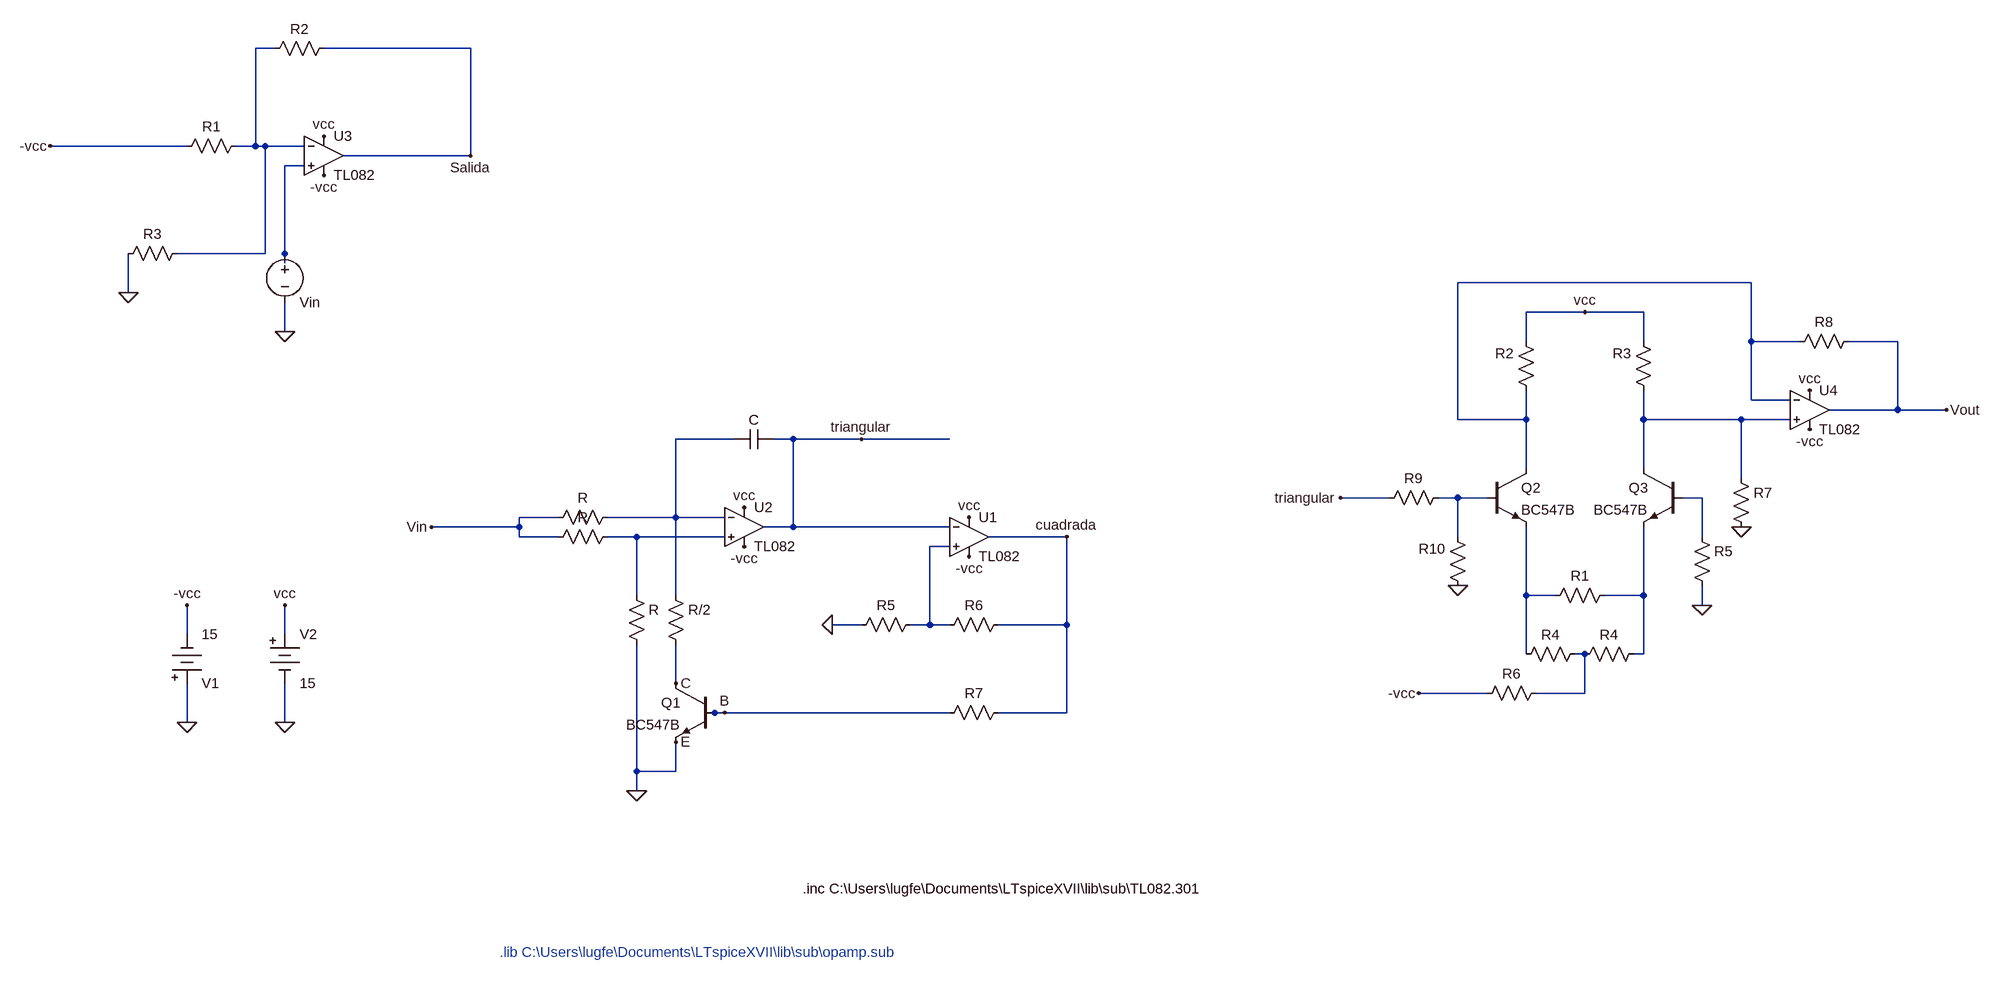
[diagram p0: schematic vco - Copy.asc]
vco - Copy.asc, the LTspice schematic file:
Version 4
SHEET 1 2788 924
WIRE -656 -656 -688 -656
WIRE -336 -656 -576 -656
WIRE -800 -496 -1024 -496
WIRE -688 -496 -688 -656
WIRE -688 -496 -720 -496
WIRE -672 -496 -688 -496
WIRE -608 -496 -672 -496
WIRE -336 -480 -336 -656
WIRE -336 -480 -544 -480
WIRE -608 -464 -640 -464
WIRE -672 -320 -672 -496
WIRE -672 -320 -816 -320
WIRE -640 -320 -640 -464
WIRE -640 -304 -640 -320
WIRE 1760 -272 1280 -272
WIRE -896 -256 -896 -320
WIRE 1488 -224 1392 -224
WIRE 1584 -224 1488 -224
WIRE -640 -192 -640 -240
WIRE 1392 -176 1392 -224
WIRE 1584 -176 1584 -224
WIRE 1760 -176 1760 -272
WIRE 1840 -176 1760 -176
WIRE 2000 -176 1920 -176
WIRE 1760 -80 1760 -176
WIRE 1824 -80 1760 -80
WIRE 2000 -64 2000 -176
WIRE 2000 -64 1888 -64
WIRE 2080 -64 2000 -64
WIRE 1280 -48 1280 -272
WIRE 1392 -48 1392 -96
WIRE 1392 -48 1280 -48
WIRE 1584 -48 1584 -96
WIRE 1744 -48 1584 -48
WIRE 1824 -48 1744 -48
WIRE 96 -16 0 -16
WIRE 192 -16 160 -16
WIRE 304 -16 192 -16
WIRE 448 -16 304 -16
WIRE 1392 32 1392 -48
WIRE 1584 32 1584 -48
WIRE 1744 48 1744 -48
WIRE 1168 80 1088 80
WIRE 1280 80 1248 80
WIRE 1328 80 1280 80
WIRE 1680 80 1648 80
WIRE -192 112 -256 112
WIRE 0 112 0 -16
WIRE 0 112 -112 112
WIRE 80 112 0 112
WIRE -256 128 -256 112
WIRE -256 128 -400 128
WIRE 192 128 192 -16
WIRE 192 128 144 128
WIRE 448 128 192 128
WIRE -256 144 -256 128
WIRE -192 144 -256 144
WIRE -64 144 -112 144
WIRE 80 144 -64 144
WIRE 640 144 512 144
WIRE 1280 144 1280 80
WIRE 1680 144 1680 80
WIRE 448 160 416 160
WIRE -64 240 -64 144
WIRE 0 240 0 112
WIRE 1392 240 1392 128
WIRE 1440 240 1392 240
WIRE 1584 240 1584 128
WIRE 1584 240 1520 240
WIRE 1680 256 1680 224
WIRE 304 288 256 288
WIRE 416 288 416 160
WIRE 416 288 384 288
WIRE 448 288 416 288
WIRE 640 288 640 144
WIRE 640 288 528 288
WIRE -800 304 -800 256
WIRE -640 304 -640 256
WIRE 1392 336 1392 240
WIRE 1488 336 1472 336
WIRE 1584 336 1584 240
WIRE 1584 336 1568 336
WIRE 0 384 0 320
WIRE 1328 400 1216 400
WIRE 1488 400 1488 336
WIRE 1488 400 1408 400
WIRE 64 432 48 432
WIRE 80 432 64 432
WIRE 448 432 80 432
WIRE 640 432 640 288
WIRE 640 432 528 432
WIRE -800 448 -800 384
WIRE -640 448 -640 384
WIRE -64 528 -64 320
WIRE 0 528 0 480
WIRE 0 528 -64 528
WIRE -64 560 -64 528
FLAG -64 560 0
FLAG 0 384 C
FLAG 0 480 E
FLAG 80 432 B
FLAG -640 256 vcc
FLAG -640 -192 0
FLAG -640 448 0
FLAG -800 256 -vcc
FLAG -800 448 0
FLAG 256 288 0
FLAG 1856 -32 -vcc
FLAG 1856 -96 vcc
FLAG 1088 80 triangular
FLAG 1280 224 0
FLAG 1488 -224 vcc
FLAG 1744 128 0
FLAG 1680 256 0
FLAG 2080 -64 Vout
FLAG 1216 400 -vcc
FLAG 112 96 vcc
FLAG 480 112 vcc
FLAG 112 160 -vcc
FLAG 480 176 -vcc
FLAG 304 -16 triangular
FLAG -336 -480 Salida
FLAG -400 128 Vin
FLAG -576 -512 vcc
FLAG -576 -448 -vcc
FLAG -1024 -496 -vcc
FLAG -896 -256 0
FLAG 640 144 cuadrada
SYMBOL res -96 96 R90
WINDOW 0 0 56 VBottom 2
WINDOW 3 32 56 VTop 2
SYMATTR InstName R
SYMATTR Value ""
SYMBOL res -96 128 R90
WINDOW 0 0 56 VBottom 2
WINDOW 3 32 56 VTop 2
SYMATTR InstName R
SYMATTR Value ""
SYMBOL res -80 224 R0
SYMATTR InstName R
SYMATTR Value ""
SYMBOL res -16 224 R0
SYMATTR InstName R/2
SYMATTR Value ""
SYMBOL res 400 272 R90
WINDOW 0 0 56 VBottom 2
WINDOW 3 32 56 VTop 2
SYMATTR InstName R5
SYMATTR Value ""
SYMBOL res 544 272 R90
WINDOW 0 0 56 VBottom 2
WINDOW 3 32 56 VTop 2
SYMATTR InstName R6
SYMATTR Value ""
SYMBOL res 432 448 R270
WINDOW 0 32 56 VTop 2
WINDOW 3 0 56 VBottom 2
SYMATTR InstName R7
SYMATTR Value ""
SYMBOL cap 160 -32 R90
WINDOW 0 0 32 VBottom 2
WINDOW 3 32 32 VTop 2
SYMATTR InstName C
SYMATTR Value ""
SYMBOL Misc\\battery -640 288 R0
WINDOW 123 0 0 Left 0
WINDOW 39 0 0 Left 0
SYMATTR InstName V2
SYMATTR Value 15
SYMBOL npn 64 384 M0
SYMATTR InstName Q1
SYMATTR Value BC547B
SYMBOL Misc\\battery -800 400 M180
WINDOW 123 0 0 Left 0
WINDOW 39 0 0 Left 0
SYMATTR InstName V1
SYMATTR Value 15
SYMBOL res 1264 64 R90
WINDOW 0 0 56 VBottom 2
WINDOW 3 32 56 VTop 2
SYMATTR InstName R9
SYMATTR Value ""
SYMBOL res 1296 240 R180
WINDOW 0 36 76 Left 2
WINDOW 3 36 40 Left 2
SYMATTR InstName R10
SYMATTR Value ""
SYMBOL npn 1328 32 R0
SYMATTR InstName Q2
SYMATTR Value BC547B
SYMBOL npn 1648 32 M0
SYMATTR InstName Q3
SYMATTR Value BC547B
SYMBOL res 1408 -80 R180
WINDOW 0 36 76 Left 2
WINDOW 3 36 40 Left 2
SYMATTR InstName R2
SYMATTR Value ""
SYMATTR SpiceLine tol=1 pwr=0.1
SYMBOL res 1600 -80 R180
WINDOW 0 36 76 Left 2
WINDOW 3 36 40 Left 2
SYMATTR InstName R3
SYMATTR Value ""
SYMBOL res 1536 224 R90
WINDOW 0 0 56 VBottom 2
WINDOW 3 32 56 VTop 2
SYMATTR InstName R1
SYMATTR Value ""
SYMBOL Opamps\\opamp2 1856 -128 R0
SYMATTR InstName U4
SYMATTR Value TL082
SYMBOL res 1728 32 R0
SYMATTR InstName R7
SYMATTR Value ""
SYMBOL res 1664 128 R0
SYMATTR InstName R5
SYMATTR Value ""
SYMBOL res 1424 384 R90
WINDOW 0 0 56 VBottom 2
WINDOW 3 32 56 VTop 2
SYMATTR InstName R6
SYMATTR Value ""
SYMBOL res 1936 -192 R90
WINDOW 0 0 56 VBottom 2
WINDOW 3 32 56 VTop 2
SYMATTR InstName R8
SYMATTR Value ""
SYMBOL res 1488 320 R90
WINDOW 0 0 56 VBottom 2
WINDOW 3 32 56 VTop 2
SYMATTR InstName R4
SYMATTR Value ""
SYMBOL res 1472 352 R270
WINDOW 0 32 56 VTop 2
WINDOW 3 0 56 VBottom 2
SYMATTR InstName R4
SYMATTR Value ""
SYMBOL voltage -640 -336 R0
WINDOW 0 24 96 Left 2
WINDOW 3 24 16 Left 2
WINDOW 123 0 0 Left 0
WINDOW 39 0 0 Left 0
SYMATTR InstName Vin
SYMATTR Value ""
SYMBOL Opamps\\opamp2 480 80 R0
SYMATTR InstName U1
SYMATTR Value TL082
SYMBOL Opamps\\opamp2 112 64 R0
SYMATTR InstName U2
SYMATTR Value TL082
SYMBOL Opamps\\opamp2 -576 -544 R0
SYMATTR InstName U3
SYMATTR Value TL082
SYMBOL res -704 -512 R90
WINDOW 0 0 56 VBottom 2
WINDOW 3 32 56 VTop 2
SYMATTR InstName R1
SYMATTR Value ""
SYMBOL res -560 -672 R90
WINDOW 0 0 56 VBottom 2
WINDOW 3 32 56 VTop 2
SYMATTR InstName R2
SYMATTR Value ""
SYMBOL res -800 -336 R90
WINDOW 0 0 56 VBottom 2
WINDOW 3 32 56 VTop 2
SYMATTR InstName R3
SYMATTR Value ""
TEXT 208 720 Left 2 !.inc C:\\Users\\lugfe\\Documents\\LTspiceXVII\\lib\\sub\\TL082.301
TEXT -288 824 Left 2 ;.lib C:\\Users\\lugfe\\Documents\\LTspiceXVII\\lib\\sub\\opamp.sub

The netlist it stands for:
* vco - Copy.asc
R N005 Vin
R N008 Vin
R N008 0
R/2 N005 C
R5 N009 0
R6 cuadrada N009
R7 B cuadrada
C triangular N005
V2 vcc 0 15
Q1 C B 0 0 BC547B
V1 0 -vcc 15
R9 N006 triangular
R10 0 N006
Q2 N003 N006 N010 0 BC547B
Q3 N004 N007 N011 0 BC547B
R2 N003 vcc tol=1 pwr=0.1
R3 N004 vcc
R1 N011 N010
XU4 N004 N003 vcc -vcc Vout TL082  ; pins In+ In- V+ V- OUT
R7 N004 0
R5 N007 0
R6 N012 -vcc
R8 Vout N003
R4 N012 N010
R4 N012 N011
Vin N002 0
XU1 N009 triangular vcc -vcc cuadrada TL082  ; pins In+ In- V+ V- OUT
XU2 N008 N005 vcc -vcc triangular TL082  ; pins In+ In- V+ V- OUT
XU3 N002 N001 vcc -vcc Salida TL082  ; pins In+ In- V+ V- OUT
R1 N001 -vcc
R2 Salida N001
R3 N001 0
.model NPN NPN
.model PNP PNP
.lib standard.bjt
.inc C:\Users\lugfe\Documents\LTspiceXVII\lib\sub\TL082.301
* .lib C:\Users\lugfe\Documents\LTspiceXVII\lib\sub\opamp.sub
.backanno
.end